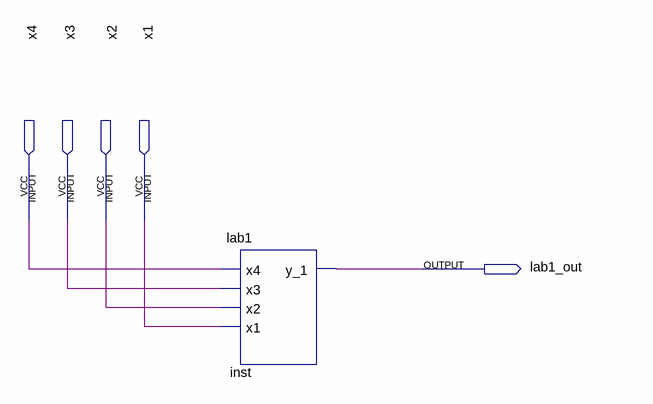
[diagram p0: schematic sheet]
// Quartus schematic lab2_1_lab1.bdf as structural Verilog: 1 symbols, 5 pins
module lab2_1_lab1 (
  input  x4,
  input  x3,
  input  x2,
  input  x1,
  output lab1_out
);

  lab1 inst (.x4(x4), .x3(x3), .x2(x2), .x1(x1), .y_1(lab1_out));
endmodule
